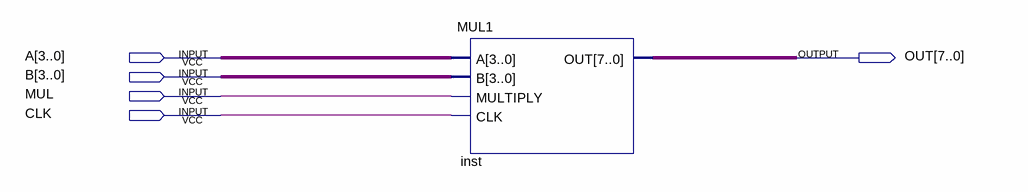
[diagram p0: schematic sheet]
// Quartus schematic MUL1TEST.bdf as structural Verilog: 1 symbols, 5 pins
module MUL1TEST (
  input  [3:0] A,
  input  [3:0] B,
  input  MUL,
  input  CLK,
  output [7:0] OUT
);

  MUL1 inst (.A(A), .B(B), .MULTIPLY(MUL), .CLK(CLK), .OUT(OUT));
endmodule
